# Altium schematic sheet Power Connections.SchDoc
size A; SheetNumber: 2; SheetTotal: 4
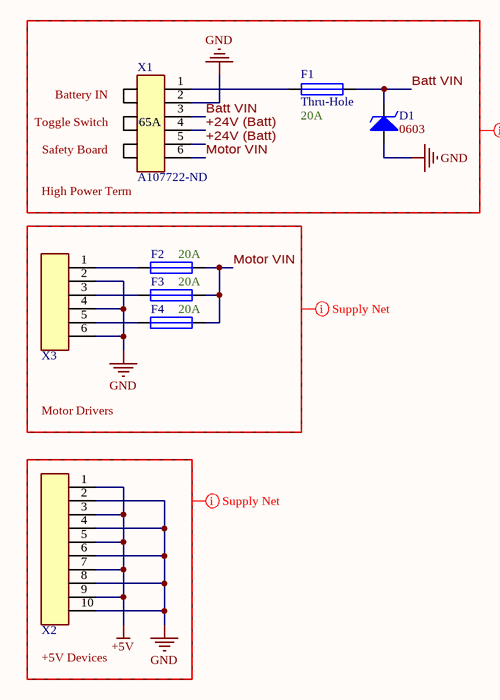
[diagram p0: Power Connections.SchDoc]

## Parts
D1  Size Package: 0603  [[Diode] SMD 0603]  (hidden comment: TVS/Zener)
F1  Thru-Hole  Capacity: 20A  [[Fuse] Thru-Hole Blade]
F2  Capacity: 20A  [[Fuse] Thru-Hole Blade]  (hidden comment: Thru-Hole)
F3  Capacity: 20A  [[Fuse] Thru-Hole Blade]  (hidden comment: Thru-Hole)
F4  Capacity: 20A  [[Fuse] Thru-Hole Blade]  (hidden comment: Thru-Hole)
X1  Supplier Part Number 1: A107722-ND  [[Screw Terminal] 6pin 65A]  (hidden comment: [Screw Terminal] 6pin 65A)
X2  [Screw Terminal] 10pin  [[Screw Terminal] 10pin]  (value not drawn)
X3  [Screw Terminal] 6pin  [[Screw Terminal] 6pin]  (value not drawn)

## Blocks framed on the sheet
Motor Drivers: F2-F4 X3
+5V Devices: X2

## Nets
+5V: X2.1 X2.3 X2.5 X2.7 X2.9
GND: D1.2(Anode) X1.2 X2.2 X2.4 X2.6 X2.8 X2.10 X3.2 X3.4 X3.6
+24V (Batt): X1.4 X1.5
Batt VIN: D1.1(Cathode) F1.2 X1.3
Motor VIN: F2.2 F3.2 F4.2 X1.6
NetF1_1: F1.1 X1.1
NetF2_1: F2.1 X3.1
NetF3_1: F3.1 X3.3
NetF4_1: F4.1 X3.5

## Layout directives
net class Supply_Nets: +5V, +24V (Batt), Batt VIN, GND, Motor VIN

## Notes on the sheet
- Battery IN
- Toggle Switch
- (near X1) High Power Term
- Safety Board
- (in symbol [Screw Terminal] 6pin 65A) 65A

## Library data of the parts
D1 = [Diode] TVS Diode: Generic; Supplier 1: DigiKey; Supplier Part Number 1: 641-1679-1-ND
F1-F4 = [Fuse] Thru-Hole Blade: Mouser Part #: *; Supplier 1: DigiKey; Supplier Part Number 1: WK6265-ND
X1 = [Screw Terminal] 6pin 65A: Remember to order 3 of the screw term for one of these!; Supplier 1: DigiKey
X2 = [Screw Terminal] 10pin: x5; Supplier 1: DigiKey; Supplier Part Number 1: 102-6145-ND
X3 = [Screw Terminal] 6pin: x3; Supplier 1: DigiKey; Supplier Part Number 1: 102-6145-ND